# Altium schematic sheet Connector.SchDoc
size A4; SheetNumber: 1; SheetTotal: 2
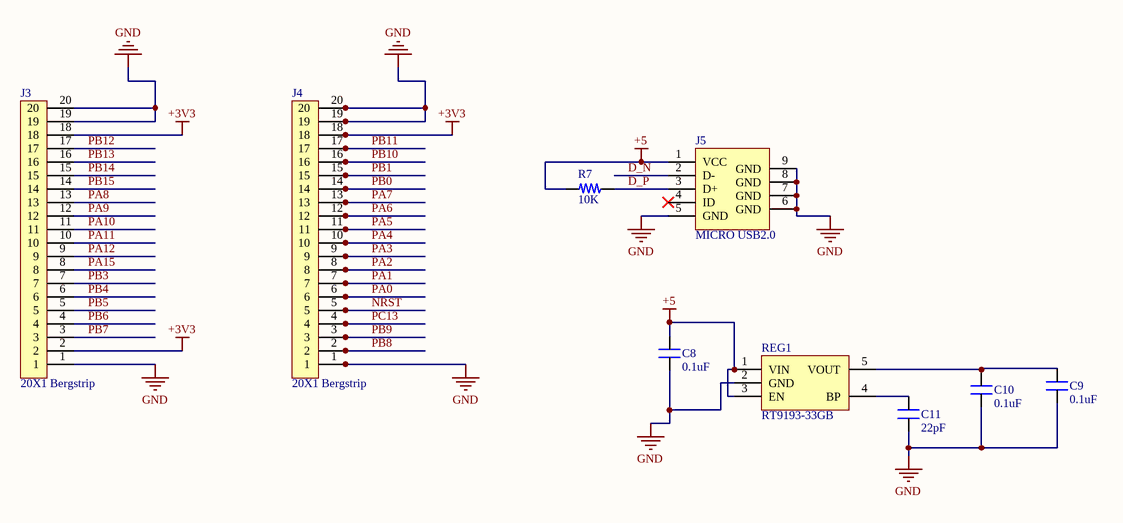
[diagram p0: Connector.SchDoc]

## Parts
C8  0.1uF  [CAP_0805]
C9  0.1uF  [CAP_0805]
C10  0.1uF  [CAP_0805]
C11  22pF  [CAP_0805]
J3  20X1 Bergstrip  [CON20_100_40D72_TH_ST]
J4  20X1 Bergstrip  [CON20_100_40D72_TH_ST]
J5  MICRO USB2.0  [CON_10118192-0001LF_SMD]
R7  10K  [RES_0805]
REG1  RT9193-33GB  [SOT23-5]

## Nets
+3V3: J3.2 J3.18 J4.18
+5: C8.2 J5.1(VCC) R7.1 REG1.1(VIN) REG1.3(EN)
GND: C8.1 C9.1 C10.1 C11.1 J3.1 J3.19 J3.20 J4.1 J4.19 J4.20 J5.5(GND) J5.6(GND) J5.7(GND) J5.8(GND) J5.9(GND) REG1.2(GND)
D_N: J5.2(D-)
D_P: J5.3(D+) R7.2
NRST: J4.5
PA0: J4.6
PA1: J4.7
PA2: J4.8
PA3: J4.9
PA4: J4.10
PA5: J4.11
PA6: J4.12
PA7: J4.13
PA8: J3.13
PA9: J3.12
PA10: J3.11
PA11: J3.10
PA12: J3.9
PA15: J3.8
PB0: J4.14
PB1: J4.15
PB3: J3.7
PB4: J3.6
PB5: J3.5
PB6: J3.4
PB7: J3.3
PB8: J4.2
PB9: J4.3
PB10: J4.16
PB11: J4.17
PB12: J3.17
PB13: J3.16
PB14: J3.15
PB15: J3.14
PC13: J4.4
NetC9_2: C9.2 C10.2 REG1.5(VOUT)
NetC11_2: C11.2 REG1.4(BP)

Not connected (* = marked no-connect by the designer): J5 4(ID)*

## Library data of the parts
C8-C10 = CAP_0.1uF-50V-5%-0805: 0.1µF ±5% 50V Ceramic Capacitor X7R 0805 (2012 Metric); Manufacturer: KEMET; Manufacturing Part Number: C0805C104J5RACTU; Case/Package: 0805 (2012 Metric); Supplier-1: Digikey; Supplier Part Number-1: 399-1171-1-ND
C11 = CAP_22pF-50V-5%-0805: 22pF ±5% 50V Ceramic Capacitor C0G, NP0 0805 (2012 Metric); Manufacturer: KEMET; Manufacturer Part Number: C0805C220J5GACTU; Case/Package: 0805; Supplier-1: Digikey; Supplier Part Number-1: 399-1113-1-ND
J3 J4 = CON-BS-PLG_20X1-100-TH-ST: 20 pin, 1 row, 2.54mm pitch bergstrip; Manufacturer: NA; Manufacturing Part Number: NA; Case/Package: TH; Supplier-1: NA; Supplier Part Number-1: NA
J5 = CON-USB_10118192-0002LF-SMD: USB - micro B USB 2.0 Receptacle Connector 5 Position Surface Mount, Right Angle; Manufacturer: Amphenol ICC (FCI); Manufacturing Part Number: 10118192-0002LF; Case/Package: SMD; Supplier-1: Digikey; Supplier Part Number-1: 609-5379-1-ND
R7 = RES_10K-0.125W-1%-0805: 10 kOhms ±1% 0.125W, 1/8W Chip Resistor 0805 (2012 Metric) Moisture Resistant Thick Film; Manufacturer: Yageo; Manufacturing Part Number: RC0805FR-0710KL; Case/Package: 0805; Supplier-1: Digikey; Supplier Part Number-1: 311-10.0KCRCT-ND
REG1 = REG_3.3V-5.5V-0.3A-SOT-23-5: Linear Voltage Regulator IC 1 Output 300mA SOT-23-5; Manufacturer: Richtek USA Inc.; Manufacturer Part Number: RT9193-33GB; Case/ Package: SOT-23-5; Supplier-1: Digikey; Supplier Part Number-1: 1028-1014-1-ND